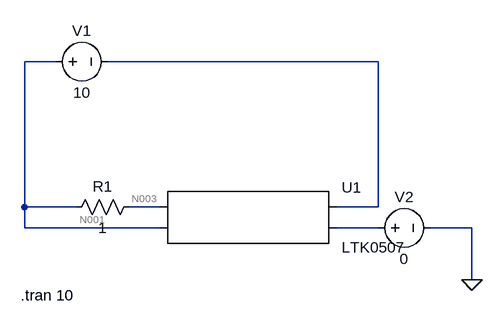
[diagram p0: schematic Sensortest.asc]
Sensortest.asc, the LTspice schematic file:
Version 4
SHEET 1 880 680
WIRE -64 -128 -112 -128
WIRE 432 -128 16 -128
WIRE -112 96 -112 -128
WIRE -32 96 -112 96
WIRE 96 96 48 96
WIRE 432 96 432 -128
WIRE 432 96 368 96
WIRE -112 128 -112 96
WIRE 96 128 -112 128
WIRE 432 128 368 128
WIRE 576 128 512 128
WIRE 576 208 576 128
FLAG 576 208 0
SYMBOL AutoGenerated\\LTK0507 224 112 R0
SYMATTR InstName U1
SYMBOL voltage -80 -128 R270
WINDOW 0 32 56 VTop 2
WINDOW 3 -32 56 VBottom 2
WINDOW 123 0 0 Left 0
WINDOW 39 0 0 Left 0
SYMATTR InstName V1
SYMATTR Value 10
SYMBOL res 64 80 R90
WINDOW 0 0 56 VBottom 2
WINDOW 3 32 56 VTop 2
SYMATTR InstName R1
SYMATTR Value 1
SYMBOL voltage 416 128 R270
WINDOW 0 32 56 VTop 2
WINDOW 3 -32 56 VBottom 2
WINDOW 123 0 0 Left 0
WINDOW 39 0 0 Left 0
SYMATTR InstName V2
SYMATTR Value 0
TEXT -118 232 Left 2 !.tran 10

The netlist it stands for:
* Sensortest.asc
* U1: LTK0507 (symbol AutoGenerated\LTK0507 not available, pins judged from their places): pin1=N003 pin2=N001 pin3=N002 pin4=N004
V1 N001 N002 10
R1 N003 N001 1
V2 N004 0 0
.tran 10
.backanno
.end

* Results of the author's LTspice run, read from the files saved beside the schematic
* Operating Point, zero values left out:
*   V(n003) = 9.524 V
*   V(n001) = 10 V
*   I(R1) = -476.2 mA
*   I(V1) = -476.2 mA
*   Ix(u1:NPN_OUT) = 476.2 mA
*   Ix(u1:VCC) = 10 pA
*   Ix(u1:GND) = -476.2 mA